# Altium schematic sheet SH1 - Buck Converter.SchDoc
size A; SheetNumber: 1; SheetTotal: 1
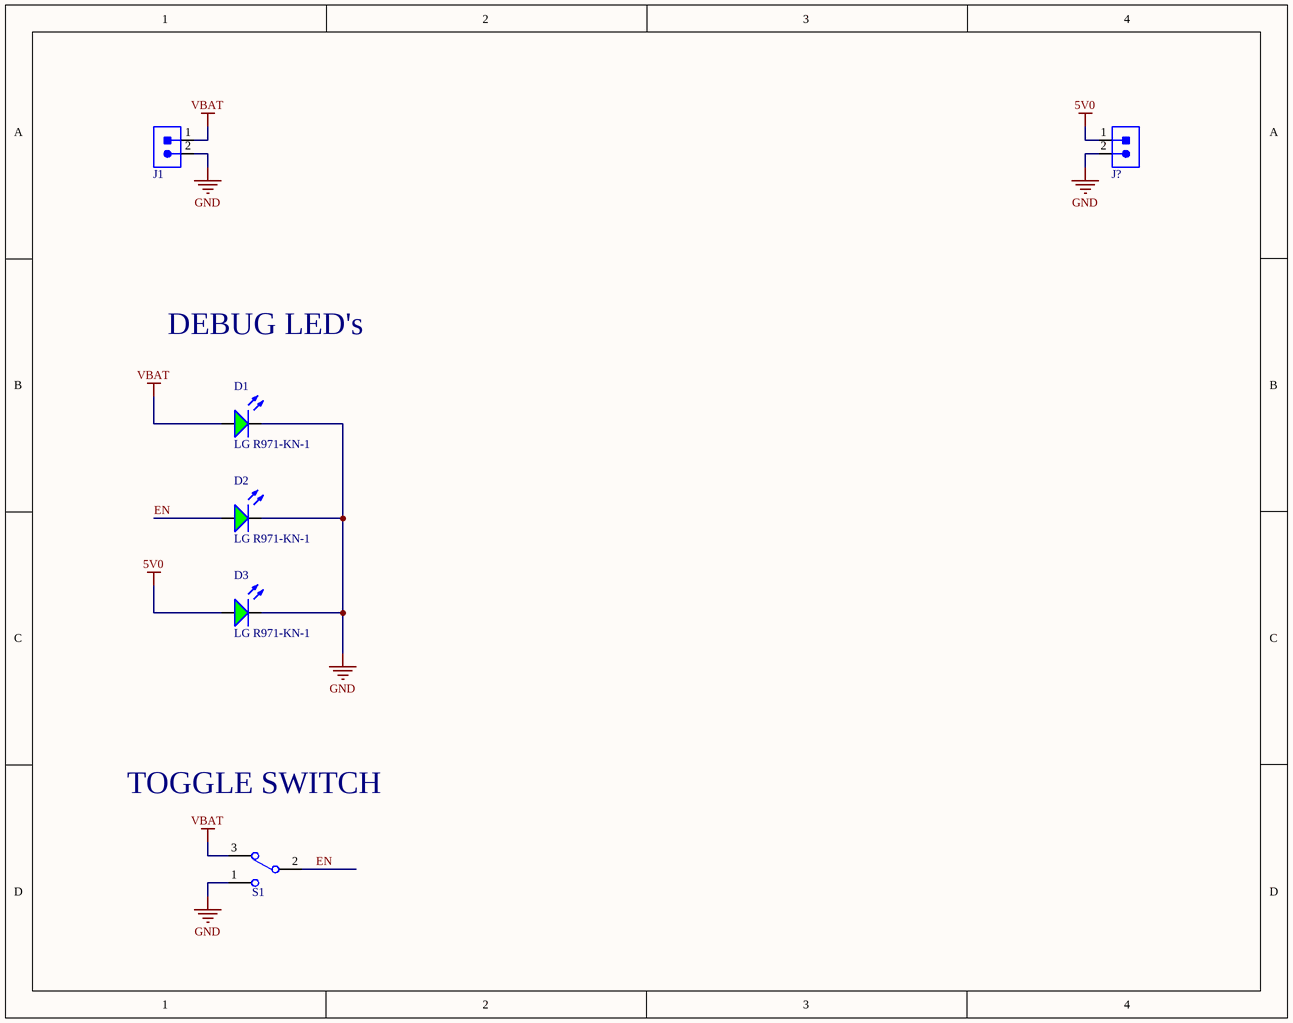
[diagram p0: SH1 - Buck Converter.SchDoc]

## Parts
D1  Manufacturer Part Number 1: LG R971-KN-1  [LED_0805_GREEN]  (hidden comment: LED_GREEN)
D2  Manufacturer Part Number 1: LG R971-KN-1  [LED_0805_GREEN]  (hidden comment: LED_GREEN)
D3  Manufacturer Part Number 1: LG R971-KN-1  [LED_0805_GREEN]  (hidden comment: LED_GREEN)
J1  CON_2POS_SCREW_TERM  [1935161]  (value not drawn)
J?  CON_2POS_SCREW_TERM  [1935161]  (value not drawn)
S1  SW_TOGGLE_SPDT  [100SP1T1B4M2QE]  (value not drawn)

## Nets
5V0: D3.1(A) J?.1
GND: D1.2(K) D2.2(K) D3.2(K) J1.2 J?.2 S1.1
VBAT: D1.1(A) J1.1 S1.3
EN: D2.1(A) S1.2

## Notes on the sheet
- DEBUG LED's
- TOGGLE SWITCH

## Library data of the parts
D1-D3 = LED_GREEN: LED GREEN DIFFUSED 0805 SMD; Manufacturer 1: OSRAM; Forward Voltage Drop: 2.2V; Package/Footprint: 0805; Supplier Part Number 1: 475-1410-1-ND; Supplier 1: Digi-Key; Mounting Type: SMD
J1 J? = CON_2POS_SCREW_TERM: TERM BLK 2POS SIDE ENTRY 5MM; Manufacturer 1: Phoenix Contact; Package/Footprint: SMD; Supplier 1: Digi-Key; Mounting Type: TH; Supplier Part Number 1: 277-1667-ND; Manufacturer Part Number 1: 1935161
S1 = SW_TOGGLE_SPDT: SWITCH TOGGLE SPDT 5A 120V; Manufacturer 1: E-Switch; Voltage Rating (DC): 28V; Package/Footprint: TH; Supplier 1: Digi-Key; Mounting Type: TH; Throw Configuration: SPDT; Supplier Part Number 1: EG2355-ND; Manufacturer Part Number 1: 100SP1T1B4M2QE